# EAGLE design stm32f407ig_breakout (EAGLE 6.4)
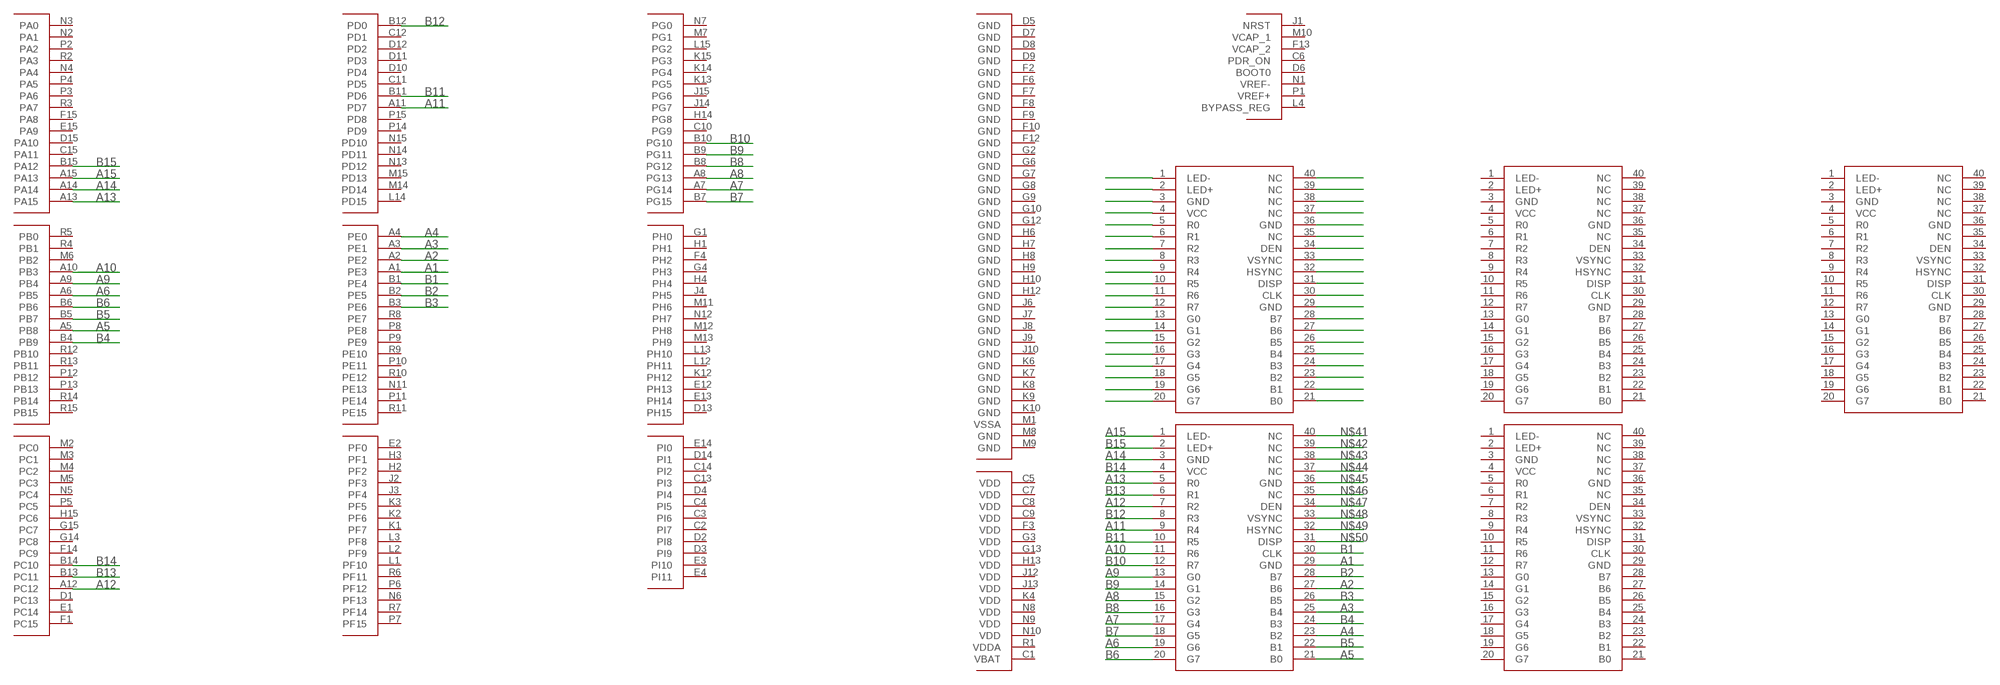
[diagram p0: schematic, sheet 1]

## Parts
TFT1  MOLEX_CONNECTORS_SMD_NHD-4.3-480272EF-ATXL  [MOLEX_CONNECTORS_SMD_40-PIN_SMD]
TFT2  MOLEX_CONNECTORS_SMD_NHD-4.3-480272EF-ATXL  [MOLEX_CONNECTORS_SMD_40-PIN_SMD]
TFT3  MOLEX_CONNECTORS_SMD_NHD-4.3-480272EF-ATXL  [MOLEX_CONNECTORS_SMD_40-PIN_SMD]
TFT4  MOLEX_CONNECTORS_SMD_NHD-4.3-480272EF-ATXL  [MOLEX_CONNECTORS_SMD_40-PIN_SMD]
TFT5  MOLEX_CONNECTORS_SMD_NHD-4.3-480272EF-ATXL  [MOLEX_CONNECTORS_SMD_40-PIN_SMD]
U$1  STM32F407IG  [UFBGA176+25]

## Nets
A1: TFT4.29(GND) U$1.A1(PE3)
A2: TFT4.27(B6) U$1.A2(PE2)
A3: TFT4.25(B4) U$1.A3(PE1)
A4: TFT4.23(B2) U$1.A4(PE0)
A5: TFT4.21(B0) U$1.A5(PB8)
A6: TFT4.19(G6) U$1.A6(PB5)
A7: TFT4.17(G4) U$1.A7(PG14)
A8: TFT4.15(G2) U$1.A8(PG13)
A9: TFT4.13(G0) U$1.A9(PB4)
A10: TFT4.11(R6) U$1.A10(PB3)
A11: TFT4.9(R4) U$1.A11(PD7)
A12: TFT4.7(R2) U$1.A12(PC12)
A13: TFT4.5(R0) U$1.A13(PA15)
A14: TFT4.3(GND) U$1.A14
A15: TFT4.1(LED-) U$1.A15(PA13)
B1: TFT4.30(CLK) U$1.B1(PE4)
B2: TFT4.28(B7) U$1.B2(PE5)
B3: TFT4.26(B5) U$1.B3(PE6)
B4: TFT4.24(B3) U$1.B4(PB9)
B5: TFT4.22(B1) U$1.B5(PB7)
B6: TFT4.20(G7) U$1.B6
B7: TFT4.18(G5) U$1.B7(PG15)
B8: TFT4.16(G3) U$1.B8(PG12)
B9: TFT4.14(G1) U$1.B9(PG11)
B10: TFT4.12(R7) U$1.B10(PG10)
B11: TFT4.10(R5) U$1.B11(PD6)
B12: TFT4.8(R3) U$1.B12(PD0)
B13: TFT4.6(R1) U$1.B13(PC11)
B14: TFT4.4(VCC) U$1.B14(PC10)
B15: TFT4.2(LED+) U$1.B15(PA12)
N$1: TFT1.1(LED-)
N$2: TFT1.2(LED+)
N$3: TFT1.3(GND)
N$4: TFT1.4(VCC)
N$5: TFT1.5(R0)
N$6: TFT1.6(R1)
N$7: TFT1.7(R2)
N$8: TFT1.8(R3)
N$9: TFT1.9(R4)
N$10: TFT1.10(R5)
N$11: TFT1.11(R6)
N$12: TFT1.12(R7)
N$13: TFT1.13(G0)
N$14: TFT1.14(G1)
N$15: TFT1.15(G2)
N$16: TFT1.16(G3)
N$17: TFT1.17(G4)
N$18: TFT1.18(G5)
N$19: TFT1.19(G6)
N$20: TFT1.20(G7)
N$21: TFT1.40(NC)
N$22: TFT1.39(NC)
N$23: TFT1.38(NC)
N$24: TFT1.37(NC)
N$25: TFT1.36(GND)
N$26: TFT1.35(NC)
N$27: TFT1.34(DEN)
N$28: TFT1.33(VSYNC)
N$29: TFT1.32(HSYNC)
N$30: TFT1.31(DISP)
N$31: TFT1.30(CLK)
N$32: TFT1.29(GND)
N$33: TFT1.28(B7)
N$34: TFT1.27(B6)
N$35: TFT1.26(B5)
N$36: TFT1.25(B4)
N$37: TFT1.24(B3)
N$38: TFT1.23(B2)
N$39: TFT1.22(B1)
N$40: TFT1.21(B0)
N$41: TFT4.40(NC)
N$42: TFT4.39(NC)
N$43: TFT4.38(NC)
N$44: TFT4.37(NC)
N$45: TFT4.36(GND)
N$46: TFT4.35(NC)
N$47: TFT4.34(DEN)
N$48: TFT4.33(VSYNC)
N$49: TFT4.32(HSYNC)
N$50: TFT4.31(DISP)
Unconnected: TFT2.1(LED-) TFT2.2(LED+) TFT2.3(GND) TFT2.4(VCC) TFT2.5(R0) TFT2.6(R1) TFT2.7(R2) TFT2.8(R3) TFT2.9(R4) TFT2.10(R5) TFT2.11(R6) TFT2.12(R7) TFT2.13(G0) TFT2.14(G1) TFT2.15(G2) TFT2.16(G3) TFT2.17(G4) TFT2.18(G5) TFT2.19(G6) TFT2.20(G7) TFT2.21(B0) TFT2.22(B1) TFT2.23(B2) TFT2.24(B3) TFT2.25(B4) TFT2.26(B5) TFT2.27(B6) TFT2.28(B7) TFT2.29(GND) TFT2.30(CLK) TFT2.31(DISP) TFT2.32(HSYNC) TFT2.33(VSYNC) TFT2.34(DEN) TFT2.35(NC) TFT2.36(GND) TFT2.37(NC) TFT2.38(NC) TFT2.39(NC) TFT2.40(NC) TFT3.1(LED-) TFT3.2(LED+) TFT3.3(GND) TFT3.4(VCC) TFT3.5(R0) TFT3.6(R1) TFT3.7(R2) TFT3.8(R3) TFT3.9(R4) TFT3.10(R5) TFT3.11(R6) TFT3.12(R7) TFT3.13(G0) TFT3.14(G1) TFT3.15(G2) TFT3.16(G3) TFT3.17(G4) TFT3.18(G5) TFT3.19(G6) TFT3.20(G7) TFT3.21(B0) TFT3.22(B1) TFT3.23(B2) TFT3.24(B3) TFT3.25(B4) TFT3.26(B5) TFT3.27(B6) TFT3.28(B7) TFT3.29(GND) TFT3.30(CLK) TFT3.31(DISP) TFT3.32(HSYNC) TFT3.33(VSYNC) TFT3.34(DEN) TFT3.35(NC) TFT3.36(GND) TFT3.37(NC) TFT3.38(NC) TFT3.39(NC) TFT3.40(NC) TFT5.1(LED-) TFT5.2(LED+) TFT5.3(GND) TFT5.4(VCC) TFT5.5(R0) TFT5.6(R1) TFT5.7(R2) TFT5.8(R3) TFT5.9(R4) TFT5.10(R5) TFT5.11(R6) TFT5.12(R7) TFT5.13(G0) TFT5.14(G1) TFT5.15(G2) TFT5.16(G3) TFT5.17(G4) TFT5.18(G5) TFT5.19(G6) TFT5.20(G7) TFT5.21(B0) TFT5.22(B1) TFT5.23(B2) TFT5.24(B3) TFT5.25(B4) TFT5.26(B5) TFT5.27(B6) TFT5.28(B7) TFT5.29(GND) TFT5.30(CLK) TFT5.31(DISP) TFT5.32(HSYNC) TFT5.33(VSYNC) TFT5.34(DEN) TFT5.35(NC) TFT5.36(GND) TFT5.37(NC) TFT5.38(NC) TFT5.39(NC) TFT5.40(NC) U$1.C1(VBAT) U$1.C2(PI7) U$1.C3(PI6) U$1.C4(PI5) U$1.C5(VDD) U$1.C6(PDR_ON) U$1.C7(VDD) U$1.C8(VDD) U$1.C9(VDD) U$1.C10(PG9) U$1.C11(PD5) U$1.C12(PD1) U$1.C13(PI3) U$1.C14(PI2) U$1.C15(PA11) U$1.D1(PC13) U$1.D2(PI8) U$1.D3(PI9) U$1.D4(PI4) U$1.D5(GND) U$1.D6(BOOT0) U$1.D7(GND) U$1.D8(GND) U$1.D9(GND) U$1.D10(PD4) U$1.D11(PD3) U$1.D12(PD2) U$1.D13(PH15) U$1.D14(PI1) U$1.D15(PA10) U$1.E1(PC14) U$1.E2(PF0) U$1.E3(PI10) U$1.E4(PI11) U$1.E12(PH13) U$1.E13(PH14) U$1.E14(PI0) U$1.E15(PA9) U$1.F1(PC15) U$1.F2(GND) U$1.F3(VDD) U$1.F4(PH2) U$1.F6(GND) U$1.F7(GND) U$1.F8(GND) U$1.F9(GND) U$1.F10(GND) U$1.F12(GND) U$1.F13(VCAP_2) U$1.F14(PC9) U$1.F15(PA8) U$1.G1(PH0) U$1.G2(GND) U$1.G3(VDD) U$1.G4(PH3) U$1.G6(GND) U$1.G7(GND) U$1.G8(GND) U$1.G9(GND) U$1.G10(GND) U$1.G12(GND) U$1.G13(VDD) U$1.G14(PC8) U$1.G15(PC7) U$1.H1 U$1.H2(PF2) U$1.H3(PF1) U$1.H4 U$1.H6(GND) U$1.H7(GND) U$1.H8(GND) U$1.H9(GND) U$1.H10(GND) U$1.H12(GND) U$1.H13(VDD) U$1.H14(PG8) U$1.H15(PC6) U$1.J1(NRST) U$1.J2(PF3) U$1.J3(PF4) U$1.J4(PH5) U$1.J6(GND) U$1.J7(GND) U$1.J8(GND) U$1.J9(GND) U$1.J10(GND) U$1.J12(VDD) U$1.J13(VDD) U$1.J14(PG7) U$1.J15(PG6) U$1.K1(PF7) U$1.K2(PF6) U$1.K3(PF5) U$1.K4(VDD) U$1.K6(GND) U$1.K7(GND) U$1.K8(GND) U$1.K9(GND) U$1.K10(GND) U$1.K12(PH12) U$1.K13(PG5) U$1.K14(PG4) U$1.K15(PG3) U$1.L1(PF10) U$1.L2(PF9) U$1.L3(PF8) U$1.L4(BYPASS_REG) U$1.L12(PH11) U$1.L13(PH10) U$1.L14(PD15) U$1.L15(PG2) U$1.M1(VSSA) U$1.M2(PC0) U$1.M3(PC1) U$1.M4(PC2) U$1.M5(PC3) U$1.M6(PB2) U$1.M7(PG1) U$1.M8(GND) U$1.M9(GND) U$1.M10(VCAP_1) U$1.M11(PH6) U$1.M12(PH8) U$1.M13(PH9) U$1.M14(PD14) U$1.M15(PD13) U$1.N1(VREF-) U$1.N2(PA1) U$1.N3(PA0) U$1.N4(PA4) U$1.N5(PC4) U$1.N6(PF13) U$1.N7(PG0) U$1.N8(VDD) U$1.N9(VDD) U$1.N10(VDD) U$1.N11(PE13) U$1.N12(PH7) U$1.N13(PD12) U$1.N14(PD11) U$1.N15(PD10) U$1.P1(VREF+) U$1.P2(PA2) U$1.P3(PA6) U$1.P4(PA5) U$1.P5(PC5) U$1.P6(PF12) U$1.P7(PF15) U$1.P8(PE8) U$1.P9(PE9) U$1.P10(PE11) U$1.P11(PE14) U$1.P12(PB12) U$1.P13(PB13) U$1.P14(PD9) U$1.P15(PD8) U$1.R1(VDDA) U$1.R2(PA3) U$1.R3(PA7) U$1.R4(PB1) U$1.R5(PB0) U$1.R6(PF11) U$1.R7(PF14) U$1.R8(PE7) U$1.R9(PE10) U$1.R10(PE12) U$1.R11(PE15) U$1.R12(PB10) U$1.R13(PB11) U$1.R14(PB14) U$1.R15(PB15)

## Library data of the parts
TFT1-TFT5 = nhd-4_3-adapter:MOLEX_CONNECTORS_SMD_NHD-4.3-480272EF-ATXL
U$1 = stm32_32bit_mcu:STM32F407IG

## Board
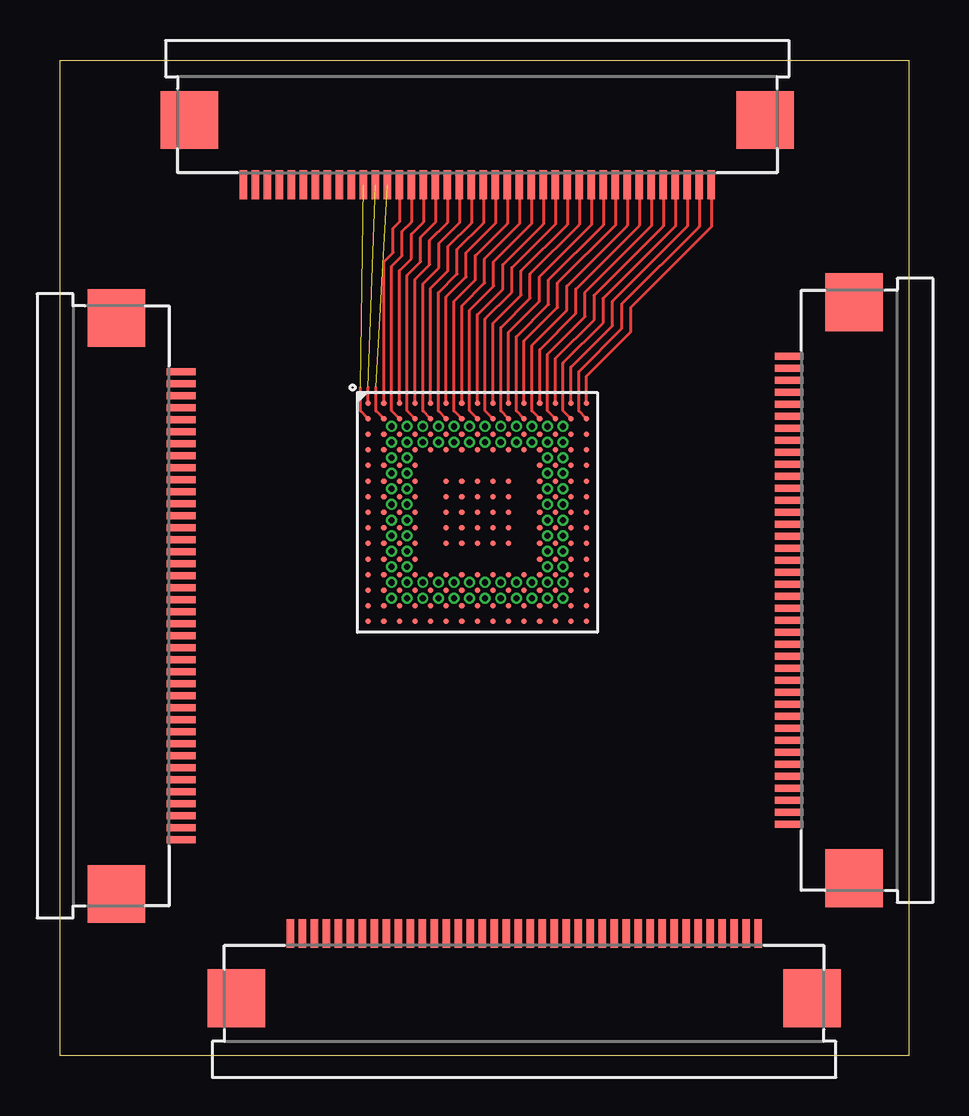
[diagram p1: board, top side]

Size 35.39 x 41.5 mm. Coordinates in mm from the lower left corner, seen from the top.
Outline: 0,41.5 35.39,41.5 35.39,0 0,0 0,41.5
Copper layers (1*16): Top 0.035mm / dielectric 1.5mm / Bottom 0.035mm
Design rules "default *": minimum track width 5mil, minimum drill 10mil, track to track 5mil, track to pad 5mil, pad to pad 5mil, via to via 5mil, smd to smd 5mil, copper to edge 13mil, drill to drill 8mil, minimum pad ring 4mil, minimum via ring 4mil, stop-mask expansion 4mil, vias tented up to drill 20mil, thermal gap 10mil

### Footprints (pad centres in the part's own frame; a part is rotated, then mirrored left to right if it is on the bottom)
MOLEX_CONNECTORS_SMD_40-PIN_SMD = smd 0.3 x 1.2: 1 -9.75,0; 2 -9.25,0; 3 -8.75,0; 4 -8.25,0; 5 -7.75,0; 6 -7.25,0; 7 -6.75,0; 8 -6.25,0; 9 -5.75,0; 10 -5.25,0; 11 -4.75,0; 12 -4.25,0; 13 -3.75,0; 14 -3.25,0; 15 -2.75,0; 16 -2.25,0; 17 -1.75,0; 18 -1.25,0; 19 -0.75,0; 20 -0.25,0; 21 0.25,0; 22 0.75,0; 23 1.25,0; 24 1.75,0; 25 2.25,0; 26 2.75,0; 27 3.25,0; 28 3.75,0; 29 4.25,0; 30 4.75,0; 31 5.25,0; 32 5.75,0; 33 6.25,0; 34 6.75,0; 35 7.25,0; 36 7.75,0; 37 8.25,0; 38 8.75,0; 39 9.25,0; 40 9.75,0 | smd 2.4 x 2.4: P$41 -12,-2.7; P$42 12,-2.7
UFBGA176+25 = smd 0.23 x 0.23: A1 -4.55,4.55; A2 -3.9,4.55; A3 -3.25,4.55; A4 -2.6,4.55; A5 -1.95,4.55; A6 -1.3,4.55; A7 -0.65,4.55; A8 0,4.55; A9 0.65,4.55; A10 1.3,4.55; A11 1.95,4.55; A12 2.6,4.55; A13 3.25,4.55; A14 3.9,4.55; A15 4.55,4.55; B1 -4.55,3.9; B2 -3.9,3.9; B3 -3.25,3.9; B4 -2.6,3.9; B5 -1.95,3.9; B6 -1.3,3.9; B7 -0.65,3.9; B8 0,3.9; B9 0.65,3.9; B10 1.3,3.9; B11 1.95,3.9; B12 2.6,3.9; B13 3.25,3.9; B14 3.9,3.9; B15 4.55,3.9; C1 -4.55,3.25; C2 -3.9,3.25; C3 -3.25,3.25; C4 -2.6,3.25; C5 -1.95,3.25; C6 -1.3,3.25; C7 -0.65,3.25; C8 0,3.25; C9 0.65,3.25; C10 1.3,3.25; C11 1.95,3.25; C12 2.6,3.25; C13 3.25,3.25; C14 3.9,3.25; C15 4.55,3.25; D1 -4.55,2.6; D2 -3.9,2.6; D3 -3.25,2.6; D4 -2.6,2.6; D5 -1.95,2.6; D6 -1.3,2.6; D7 -0.65,2.6; D8 0,2.6; D9 0.65,2.6; D10 1.3,2.6; D11 1.95,2.6; D12 2.6,2.6; D13 3.25,2.6; D14 3.9,2.6; D15 4.55,2.6; E1 -4.55,1.95; E2 -3.9,1.95; E3 -3.25,1.95; E4 -2.6,1.95; E12 2.6,1.95; E13 3.25,1.95; E14 3.9,1.95; E15 4.55,1.95; F1 -4.55,1.3; F2 -3.9,1.3; F3 -3.25,1.3; F4 -2.6,1.3; F6 -1.3,1.3; F7 -0.65,1.3; F8 0,1.3; F9 0.65,1.3; F10 1.3,1.3; F12 2.6,1.3; F13 3.25,1.3; F14 3.9,1.3; F15 4.55,1.3; G1 -4.55,0.65; G2 -3.9,0.65; G3 -3.25,0.65; G4 -2.6,0.65; G6 -1.3,0.65; G7 -0.65,0.65; G8 0,0.65; G9 0.65,0.65; G10 1.3,0.65; G12 2.6,0.65; G13 3.25,0.65; G14 3.9,0.65; G15 4.55,0.65; H1 -4.55,0; H2 -3.9,0; H3 -3.25,0; H4 -2.6,0; H6 -1.3,0; H7 -0.65,0; H8 0,0; H9 0.65,0; H10 1.3,0; H12 2.6,0; H13 3.25,0; H14 3.9,0; H15 4.55,0; J1 -4.55,-0.65; J2 -3.9,-0.65; J3 -3.25,-0.65; J4 -2.6,-0.65; J6 -1.3,-0.65; J7 -0.65,-0.65; J8 0,-0.65; J9 0.65,-0.65; J10 1.3,-0.65; J12 2.6,-0.65; J13 3.25,-0.65; J14 3.9,-0.65; J15 4.55,-0.65; K1 -4.55,-1.3; K2 -3.9,-1.3; K3 -3.25,-1.3; K4 -2.6,-1.3; K6 -1.3,-1.3; K7 -0.65,-1.3; K8 0,-1.3; K9 0.65,-1.3; K10 1.3,-1.3; K12 2.6,-1.3; K13 3.25,-1.3; K14 3.9,-1.3; K15 4.55,-1.3; L1 -4.55,-1.95; L2 -3.9,-1.95; L3 -3.25,-1.95; L4 -2.6,-1.95; L12 2.6,-1.95; L13 3.25,-1.95; L14 3.9,-1.95; L15 4.55,-1.95; M1 -4.55,-2.6; M2 -3.9,-2.6; M3 -3.25,-2.6; M4 -2.6,-2.6; M5 -1.95,-2.6; M6 -1.3,-2.6; M7 -0.65,-2.6; M8 0,-2.6; M9 0.65,-2.6; M10 1.3,-2.6; M11 1.95,-2.6; M12 2.6,-2.6; M13 3.25,-2.6; M14 3.9,-2.6; M15 4.55,-2.6; N1 -4.55,-3.25; N2 -3.9,-3.25; N3 -3.25,-3.25; N4 -2.6,-3.25; N5 -1.95,-3.25; N6 -1.3,-3.25; N7 -0.65,-3.25; N8 0,-3.25; N9 0.65,-3.25; N10 1.3,-3.25; N11 1.95,-3.25; N12 2.6,-3.25; N13 3.25,-3.25; N14 3.9,-3.25; N15 4.55,-3.25; P1 -4.55,-3.9; P2 -3.9,-3.9; P3 -3.25,-3.9; P4 -2.6,-3.9; P5 -1.95,-3.9; P6 -1.3,-3.9; P7 -0.65,-3.9; P8 0,-3.9; P9 0.65,-3.9; P10 1.3,-3.9; P11 1.95,-3.9; P12 2.6,-3.9; P13 3.25,-3.9; P14 3.9,-3.9; P15 4.55,-3.9; R1 -4.55,-4.55; R2 -3.9,-4.55; R3 -3.25,-4.55; R4 -2.6,-4.55; R5 -1.95,-4.55; R6 -1.3,-4.55; R7 -0.65,-4.55; R8 0,-4.55; R9 0.65,-4.55; R10 1.3,-4.55; R11 1.95,-4.55; R12 2.6,-4.55; R13 3.25,-4.55; R14 3.9,-4.55; R15 4.55,-4.55

### Placement (x,y rotation side)
TFT1  30.4,19.4 90 top
TFT2  19.35,5.1 0 top
TFT3  5.05,18.75 270 top
TFT4  17.4,36.3 180 top
TFT5  26.5,-15.37 0 top  (outside the outline)
U$1  17.4,22.65 0 top

### Tracks (layer width: path | path; a pad name or v marks a point on that pad's centre or on a via)
A1  (1 unrouted)
  Top 0.127: U$1.A1 12.85,27.85
A2
  Top 0.127: U$1.A2 13.5,33.09 13.89,33.48 13.89,34.49 14.15,34.75 TFT4.27
A3
  Top 0.127: U$1.A3 14.15,32.72 14.65,33.22 14.65,34.24 15.15,34.74 TFT4.25
A4
  Top 0.127: U$1.A4 14.8,32.36 15.41,32.97 15.41,33.98 16.15,34.72 TFT4.23
A5
  Top 0.127: U$1.A5 15.45,31.99 16.17,32.72 16.17,33.73 17.15,34.71 TFT4.21
A6
  Top 0.127: U$1.A6 16.1,31.62 16.94,32.46 16.94,33.48 18.15,34.69 TFT4.19
A7
  Top 0.127: U$1.A7 16.75,31.26 17.7,32.21 17.7,33.22 19.15,34.67 TFT4.17
A8
  Top 0.127: U$1.A8 17.4,30.89 18.46,31.95 18.46,32.97 20.15,34.66 TFT4.15
A9
  Top 0.127: U$1.A9 18.05,30.53 19.22,31.7 19.22,32.72 21.15,34.64 TFT4.13
A10
  Top 0.127: U$1.A10 18.7,30.16 19.98,31.45 19.98,32.46 22.15,34.63 TFT4.11
A11
  Top 0.127: U$1.A11 19.35,29.79 20.75,31.19 20.75,32.21 23.15,34.61 TFT4.9
A12
  Top 0.127: U$1.A12 20,29.43 21.51,30.94 21.51,31.95 24.15,34.59 TFT4.7
A13
  Top 0.127: U$1.A13 20.65,29.06 22.27,30.68 22.27,31.7 25.15,34.58 TFT4.5
A14
  Top 0.127: U$1.A14 21.3,28.7 23.03,30.43 23.03,31.45 26.15,34.56 TFT4.3
A15
  Top 0.127: U$1.A15 21.95,28.33 23.8,30.17 23.8,31.19 26.46,33.86 26.91,34.3 27.15,34.55 TFT4.1
B1  (1 unrouted)
  Top 0.127: U$1.B1 12.52,26.88 12.52,27.85
B2  (1 unrouted)
  Top 0.127: U$1.B2 13.17,26.88 13.17,27.85
B3
  Top 0.127: U$1.B3 13.83,26.88 13.83,32.91 14.27,33.35 14.27,34.37 14.65,34.75 TFT4.26
B4
  Top 0.127: U$1.B4 14.47,26.88 14.47,32.54 15.03,33.1 15.03,34.11 15.65,34.73 TFT4.24
B5
  Top 0.127: U$1.B5 15.12,26.88 15.12,32.17 15.79,32.84 15.79,33.86 16.65,34.71 TFT4.22
B6
  Top 0.127: U$1.B6 15.77,26.88 15.77,31.81 16.56,32.59 16.56,33.6 17.65,34.7 TFT4.20
B7
  Top 0.127: U$1.B7 16.42,26.88 16.42,31.44 17.32,32.33 17.32,33.35 18.65,34.68 TFT4.18
B8
  Top 0.127: U$1.B8 17.08,26.88 17.08,31.08 18.08,32.08 18.08,33.1 19.65,34.67 TFT4.16
B9
  Top 0.127: U$1.B9 17.72,26.88 17.72,30.71 18.84,31.83 18.84,32.84 20.65,34.65 TFT4.14
B10
  Top 0.127: U$1.B10 18.38,26.88 18.38,30.34 19.6,31.57 19.6,32.59 21.65,34.63 TFT4.12
B11
  Top 0.127: U$1.B11 19.02,26.88 19.02,29.98 20.37,31.32 20.37,32.33 22.65,34.62 TFT4.10
B12
  Top 0.127: U$1.B12 19.67,26.88 19.67,29.61 21.13,31.06 21.13,32.08 23.65,34.6 TFT4.8
B13
  Top 0.127: U$1.B13 20.33,26.88 20.33,29.24 21.89,30.81 21.89,31.83 24.65,34.59 TFT4.6
B14
  Top 0.127: U$1.B14 20.97,26.88 20.97,28.88 22.65,30.56 22.65,31.57 25.65,34.57 TFT4.4
B15
  Top 0.127: U$1.B15 21.62,26.88 21.62,28.51 23.41,30.3 23.41,31.32 26.65,34.55 TFT4.2
N$51  (via drill 0.25 pad 0.36)
  other vias: 13.83,26.23
N$52  (via drill 0.25 pad 0.36)
  other vias: 13.83,25.58
N$53  (via drill 0.25 pad 0.36)
  other vias: 13.83,24.93
N$54  (via drill 0.25 pad 0.36)
  other vias: 13.83,24.28
N$55  (via drill 0.25 pad 0.36)
  other vias: 13.83,23.63
N$56  (via drill 0.25 pad 0.36)
  other vias: 13.83,22.98
N$57  (via drill 0.25 pad 0.36)
  other vias: 13.83,22.33
N$58  (via drill 0.25 pad 0.36)
  other vias: 13.83,21.03
N$59  (via drill 0.25 pad 0.36)
  other vias: 13.83,21.68
N$60  (via drill 0.25 pad 0.36)
  other vias: 13.83,20.38
N$61  (via drill 0.25 pad 0.36)
  other vias: 13.83,19.73
N$62  (via drill 0.25 pad 0.36)
  other vias: 13.83,19.08
N$63  (via drill 0.25 pad 0.36)
  other vias: 14.47,25.58
N$64  (via drill 0.25 pad 0.36)
  other vias: 14.47,24.93
N$65  (via drill 0.25 pad 0.36)
  other vias: 14.47,24.28
N$66  (via drill 0.25 pad 0.36)
  other vias: 14.47,23.63
N$67  (via drill 0.25 pad 0.36)
  other vias: 14.47,22.98
N$68  (via drill 0.25 pad 0.36)
  other vias: 14.47,22.33
N$69  (via drill 0.25 pad 0.36)
  other vias: 14.47,21.68
N$70  (via drill 0.25 pad 0.36)
  other vias: 14.47,21.03
N$71  (via drill 0.25 pad 0.36)
  other vias: 14.47,20.38
N$72  (via drill 0.25 pad 0.36)
  other vias: 14.47,19.73
N$73  (via drill 0.25 pad 0.36)
  other vias: 14.47,19.08
N$74  (via drill 0.25 pad 0.36)
  other vias: 14.47,26.23
N$75  (via drill 0.25 pad 0.36)
  other vias: 15.12,25.58
N$76  (via drill 0.25 pad 0.36)
  other vias: 15.77,25.58
N$77  (via drill 0.25 pad 0.36)
  other vias: 16.42,25.58
N$78  (via drill 0.25 pad 0.36)
  other vias: 17.08,25.58
N$79  (via drill 0.25 pad 0.36)
  other vias: 17.72,25.58
N$80  (via drill 0.25 pad 0.36)
  other vias: 18.38,25.58
N$81  (via drill 0.25 pad 0.36)
  other vias: 19.02,25.58
N$82  (via drill 0.25 pad 0.36)
  other vias: 19.67,25.58
N$83  (via drill 0.25 pad 0.36)
  other vias: 20.33,25.58
N$84  (via drill 0.25 pad 0.36)
  other vias: 20.97,25.58
N$85  (via drill 0.25 pad 0.36)
  other vias: 15.12,26.23
N$86  (via drill 0.25 pad 0.36)
  other vias: 15.77,26.23
N$87  (via drill 0.25 pad 0.36)
  other vias: 16.42,26.23
N$88  (via drill 0.25 pad 0.36)
  other vias: 17.08,26.23
N$89  (via drill 0.25 pad 0.36)
  other vias: 17.72,26.23
N$90  (via drill 0.25 pad 0.36)
  other vias: 18.38,26.23
N$91  (via drill 0.25 pad 0.36)
  other vias: 19.02,26.23
N$92  (via drill 0.25 pad 0.36)
  other vias: 19.67,26.23
N$93  (via drill 0.25 pad 0.36)
  other vias: 20.33,26.23
N$94  (via drill 0.25 pad 0.36)
  other vias: 20.97,26.23
N$95  (via drill 0.25 pad 0.36)
  other vias: 15.12,19.08
N$96  (via drill 0.25 pad 0.36)
  other vias: 15.12,19.73
N$97  (via drill 0.25 pad 0.36)
  other vias: 15.77,19.73
N$98  (via drill 0.25 pad 0.36)
  other vias: 15.77,19.08
N$99  (via drill 0.25 pad 0.36)
  other vias: 16.42,19.73
N$100  (via drill 0.25 pad 0.36)
  other vias: 16.42,19.08
N$101  (via drill 0.25 pad 0.36)
  other vias: 17.08,19.08
N$102  (via drill 0.25 pad 0.36)
  other vias: 17.72,19.08
N$103  (via drill 0.25 pad 0.36)
  other vias: 18.38,19.08
N$104  (via drill 0.25 pad 0.36)
  other vias: 19.02,19.08
N$105  (via drill 0.25 pad 0.36)
  other vias: 19.67,19.08
N$106  (via drill 0.25 pad 0.36)
  other vias: 20.33,19.08
N$107  (via drill 0.25 pad 0.36)
  other vias: 20.97,19.08
N$108  (via drill 0.25 pad 0.36)
  other vias: 20.97,19.73
N$109  (via drill 0.25 pad 0.36)
  other vias: 20.33,19.73
N$110  (via drill 0.25 pad 0.36)
  other vias: 19.67,19.73
N$111  (via drill 0.25 pad 0.36)
  other vias: 19.02,19.73
N$112  (via drill 0.25 pad 0.36)
  other vias: 18.38,19.73
N$113  (via drill 0.25 pad 0.36)
  other vias: 17.72,19.73
N$114  (via drill 0.25 pad 0.36)
  other vias: 17.08,19.73
N$115  (via drill 0.25 pad 0.36)
  other vias: 20.33,20.38
N$116  (via drill 0.25 pad 0.36)
  other vias: 20.33,21.03
N$117  (via drill 0.25 pad 0.36)
  other vias: 20.33,21.68
N$118  (via drill 0.25 pad 0.36)
  other vias: 20.33,22.33
N$119  (via drill 0.25 pad 0.36)
  other vias: 20.33,22.98
N$120  (via drill 0.25 pad 0.36)
  other vias: 20.33,23.63
N$121  (via drill 0.25 pad 0.36)
  other vias: 20.33,24.28
N$122  (via drill 0.25 pad 0.36)
  other vias: 20.33,24.93
N$123  (via drill 0.25 pad 0.36)
  other vias: 20.97,24.93
N$124  (via drill 0.25 pad 0.36)
  other vias: 20.97,24.28
N$125  (via drill 0.25 pad 0.36)
  other vias: 20.97,23.63
N$126  (via drill 0.25 pad 0.36)
  other vias: 20.97,22.98
N$127  (via drill 0.25 pad 0.36)
  other vias: 20.97,22.33
N$128  (via drill 0.25 pad 0.36)
  other vias: 20.97,21.68
N$129  (via drill 0.25 pad 0.36)
  other vias: 20.97,21.03
N$130  (via drill 0.25 pad 0.36)
  other vias: 20.97,20.38